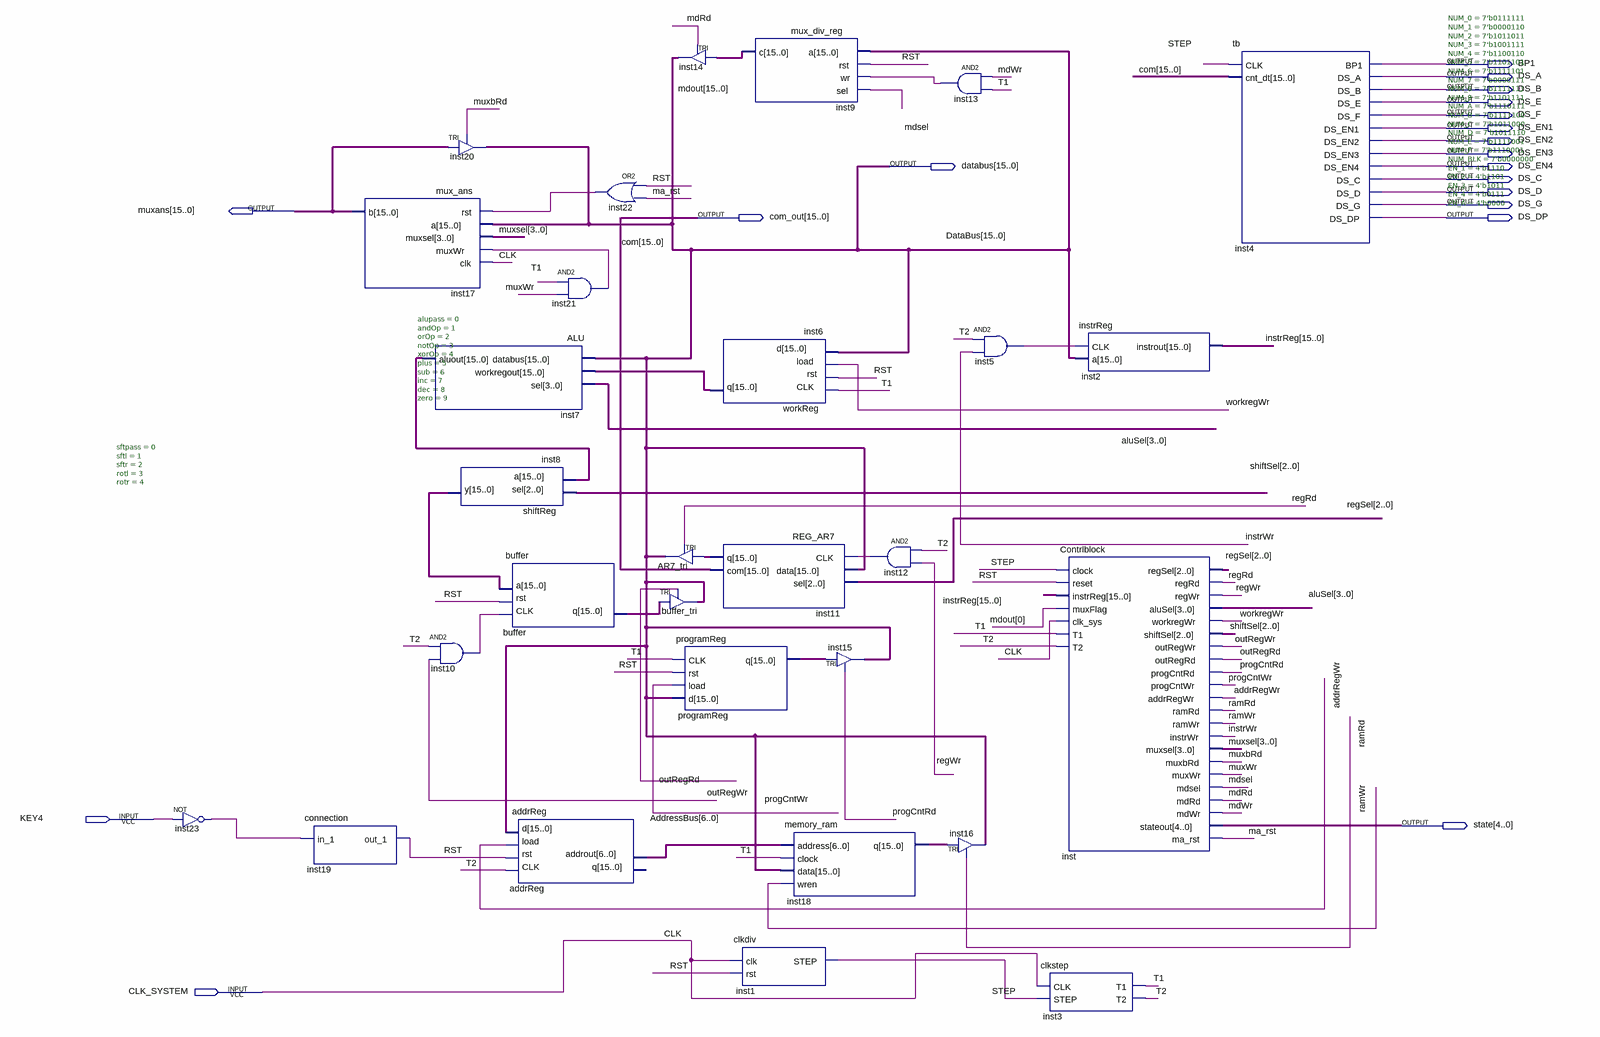
[diagram p0: schematic sheet]
// Quartus schematic CPU16bit.bdf as structural Verilog: 29 symbols, 19 pins
module CPU16bit (
  input  KEY4,
  input  CLK_SYSTEM,
  output BP1,
  output DS_A,
  output DS_B,
  output DS_E,
  output DS_F,
  output DS_EN1,
  output DS_EN2,
  output DS_EN3,
  output [15:0] databus,
  output DS_EN4,
  output DS_C,
  output DS_D,
  output DS_G,
  output [15:0] muxans,
  output [15:0] com_out,
  output DS_DP,
  output [4:0] state
);

  wire addrRegWr, inst5_out, inst10_out, inst12_out, inst13_out, inst21_out, inst22_out, inst23_out, instrWr,
       ma_rst, mdRd, mdsel, mdWr, muxbRd, muxWr, outRegRd, outRegWr, progCntRd, progCntWr, ramRd, ramWr,
       regRd, regWr, RST, STEP, T1, T2, workregWr;
  wire [2:0] regSel, shiftSel;
  wire [3:0] aluSel, muxsel;
  wire [6:0] AddressBus;
  wire [15:0] buffer_q, inst6_q, inst7_aluout, inst8_y, inst11_q, inst18_q, instrReg, mdout, programReg_q;

  not inst23 (inst23_out, KEY4);
  connection inst19 (.in_1(inst23_out), .out_1(RST));
  mux_ans inst17 (.rst(inst22_out), .a(databus), .muxsel(muxsel), .muxWr(inst21_out), .clk(CLK_SYSTEM), .b(muxans));
  ALU #(.alupass(0), .andOp(1), .orOp(2), .notOp(3), .xorOp(4), .plus(5), .sub(6), .inc(7), .dec(8), .zero(9)) inst7 (
    .databus(databus), .workregout(inst6_q), .sel(aluSel), .aluout(inst7_aluout));
  TRI inst20[15:0] (.IN(muxans), .OE(muxbRd), .OUT(databus));
  shiftReg #(.sftpass(0), .sftl(1), .sftr(2), .rotl(3), .rotr(4)) inst8 (.sel(shiftSel), .a(inst7_aluout), .y(inst8_y));
  and inst10 (inst10_out, T2, outRegWr);
  buffer buffer (.CLK(inst10_out), .rst(RST), .a(inst8_y), .q(buffer_q));
  addrReg addrReg (.CLK(T2), .rst(RST), .load(addrRegWr), .d(databus), .addrout(AddressBus));  // open: q
  and inst21 (inst21_out, T1, muxWr);
  or inst22 (inst22_out, RST, ma_rst);
  TRI inst14[15:0] (.IN(mdout), .OE(mdRd), .OUT(databus));
  TRI AR7_tri[15:0] (.IN(inst11_q), .OE(regRd), .OUT(databus));
  TRI buffer_tri[15:0] (.IN(buffer_q), .OE(outRegRd), .OUT(databus));
  programReg programReg (.CLK(T1), .rst(RST), .load(progCntWr), .d(databus), .q(programReg_q));
  workReg inst6 (.CLK(T1), .rst(RST), .load(workregWr), .d(databus), .q(inst6_q));
  REG_AR7 inst11 (.CLK(inst12_out), .data(databus), .sel(regSel), .q(inst11_q), .com(com_out));
  clkdiv inst1 (.clk(CLK_SYSTEM), .rst(RST), .STEP(STEP));
  mux_div_reg inst9 (.a(databus), .rst(RST), .wr(inst13_out), .sel(mdsel), .c(mdout));
  memory_ram inst18 (.address(AddressBus), .clock(T1), .data(databus), .wren(ramWr), .q(inst18_q));
  TRI inst15[15:0] (.IN(programReg_q), .OE(progCntRd), .OUT(databus));
  and inst12 (inst12_out, T2, regWr);
  and inst13 (inst13_out, mdWr, T1);
  and inst5 (inst5_out, T2, instrWr);
  TRI inst16[15:0] (.IN(inst18_q), .OE(ramRd), .OUT(databus));
  clkstep inst3 (.CLK(CLK_SYSTEM), .STEP(STEP), .T1(T1), .T2(T2));
  instrReg inst2 (.CLK(inst5_out), .a(databus), .instrout(instrReg));
  Contrlblock inst (
    .clock(STEP), .reset(RST), .instrReg(instrReg), .muxFlag(mdout[0]), .clk_sys(CLK_SYSTEM), .T1(T1),
    .T2(T2), .regSel(regSel), .regRd(regRd), .regWr(regWr), .aluSel(aluSel), .workregWr(workregWr),
    .shiftSel(shiftSel), .outRegWr(outRegWr), .outRegRd(outRegRd), .progCntRd(progCntRd),
    .progCntWr(progCntWr), .addrRegWr(addrRegWr), .ramRd(ramRd), .ramWr(ramWr), .instrWr(instrWr),
    .muxsel(muxsel), .muxbRd(muxbRd), .muxWr(muxWr), .mdsel(mdsel), .mdRd(mdRd), .mdWr(mdWr),
    .stateout(state), .ma_rst(ma_rst));
  tb #(.NUM_0(7'b0111111), .NUM_1(7'b0000110), .NUM_2(7'b1011011), .NUM_3(7'b1001111), .NUM_4(7'b1100110), .NUM_5(7'b1101101), .NUM_6(7'b1111101), .NUM_7(7'b0000111), .NUM_8(7'b1111111), .NUM_9(7'b1101111), .NUM_A(7'b1110111), .NUM_B(7'b1111100), .NUM_C(7'b1011000), .NUM_D(7'b1011110), .NUM_E(7'b1111001), .NUM_F(7'b1110001), .NUM_BLK(7'b0000000), .EN_1(4'b1110), .EN_2(4'b1101), .EN_3(4'b1011), .EN_4(4'b0111), .EN_A(4'b0000)) inst4 (
    .CLK(STEP), .cnt_dt(com_out), .BP1(BP1), .DS_A(DS_A), .DS_B(DS_B), .DS_E(DS_E), .DS_F(DS_F),
    .DS_EN1(DS_EN1), .DS_EN2(DS_EN2), .DS_EN3(DS_EN3), .DS_EN4(DS_EN4), .DS_C(DS_C), .DS_D(DS_D),
    .DS_G(DS_G), .DS_DP(DS_DP));

  // Other names for the same wires on the sheet: CLK = CLK_SYSTEM; com[15:0] = com_out
endmodule
